# EAGLE design sensor (EAGLE 6.6.0)
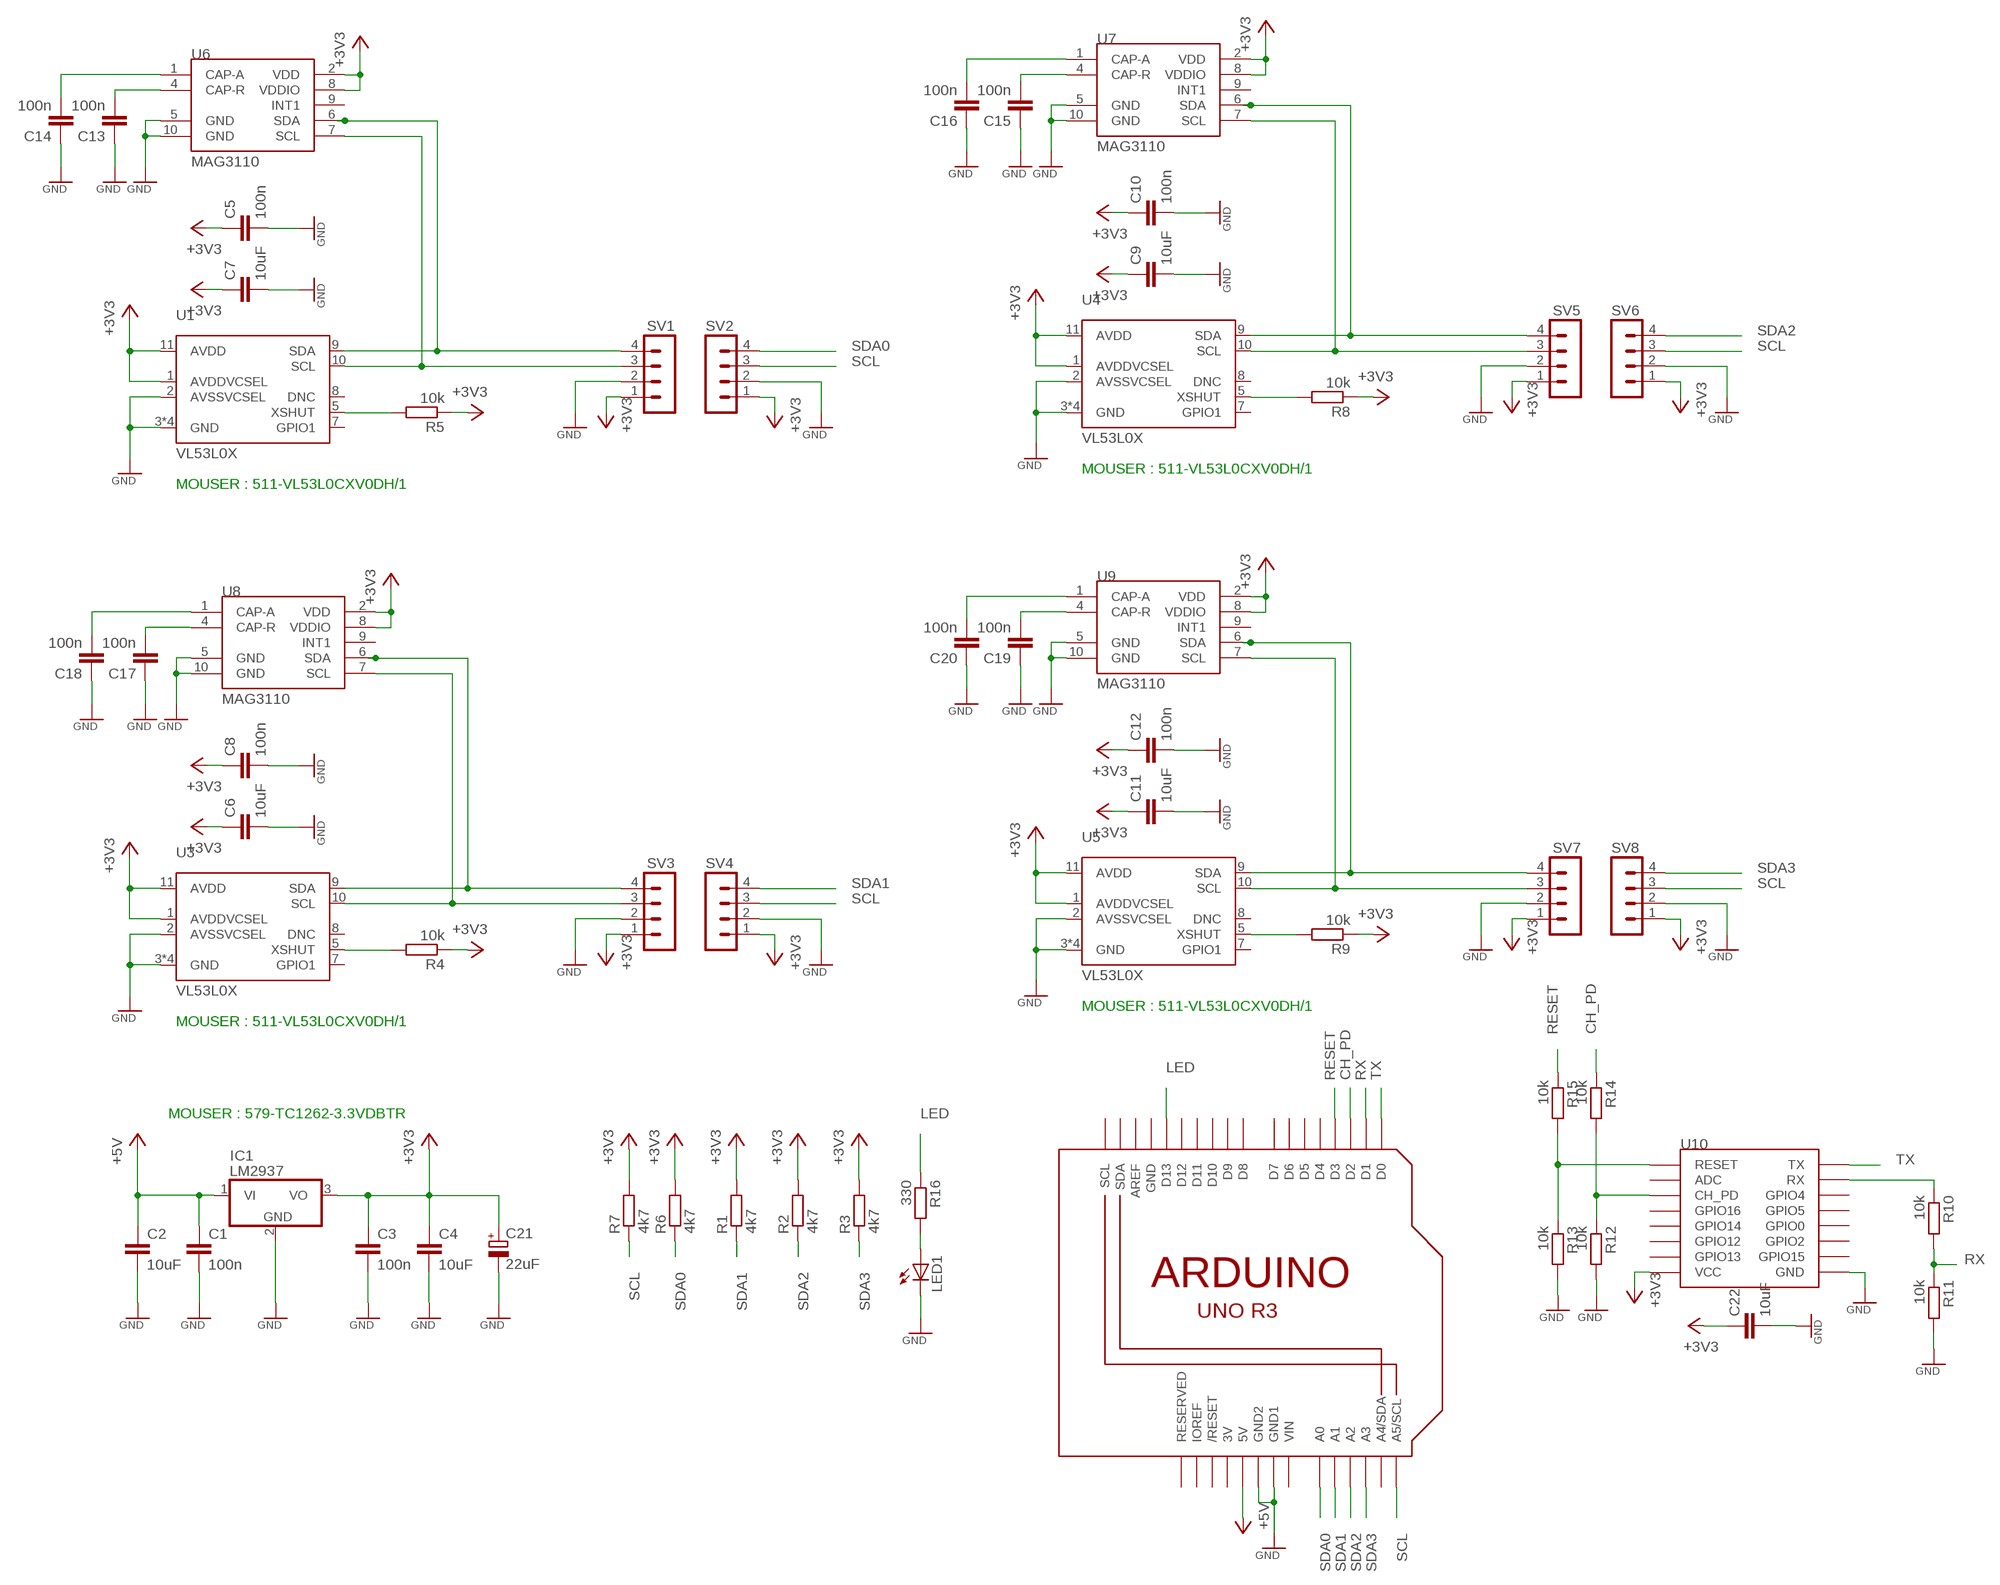
[diagram p0: schematic, sheet 1]

## Parts
C1  100n  C-EUC0805K  [C0805K]
C2  10uF  C-EUC0805K  [C0805K]
C3  100n  C-EUC0805K  [C0805K]
C4  10uF  C-EUC0805K  [C0805K]
C5  100n  C-EUC0805K  [C0805K]
C6  10uF  C-EUC0805K  [C0805K]
C7  10uF  C-EUC0805K  [C0805K]
C8  100n  C-EUC0805K  [C0805K]
C9  10uF  C-EUC0805K  [C0805K]
C10  100n  C-EUC0805K  [C0805K]
C11  10uF  C-EUC0805K  [C0805K]
C12  100n  C-EUC0805K  [C0805K]
C13  100n  C-EUC0805K  [C0805K]
C14  100n  C-EUC0805K  [C0805K]
C15  100n  C-EUC0805K  [C0805K]
C16  100n  C-EUC0805K  [C0805K]
C17  100n  C-EUC0805K  [C0805K]
C18  100n  C-EUC0805K  [C0805K]
C19  100n  C-EUC0805K  [C0805K]
C20  100n  C-EUC0805K  [C0805K]
C21  22uF  CPOL-EU153CLV-0405  [153CLV-0405]
C22  10uF  C-EUC0805K  [C0805K]
IC1  LM2937  [TO263-3]
LED1  LEDSML1206  [SML1206]
R1  4k7  R-EU_R0805  [R0805]
R2  4k7  R-EU_R0805  [R0805]
R3  4k7  R-EU_R0805  [R0805]
R4  10k  R-EU_R0805  [R0805]
R5  10k  R-EU_R0805  [R0805]
R6  4k7  R-EU_R0805  [R0805]
R7  4k7  R-EU_R0805  [R0805]
R8  10k  R-EU_R0805  [R0805]
R9  10k  R-EU_R0805  [R0805]
R10  10k  R-EU_R0805  [R0805]
R11  10k  R-EU_R0805  [R0805]
R12  10k  R-EU_R0805  [R0805]
R13  10k  R-EU_R0805  [R0805]
R14  10k  R-EU_R0805  [R0805]
R15  10k  R-EU_R0805  [R0805]
R16  330  R-EU_R0805  [R0805]
SV1  MA04-1  [MA04-1]
SV2  MA04-1  [MA04-1]
SV3  MA04-1  [MA04-1]
SV4  MA04-1  [MA04-1]
SV5  MA04-1  [MA04-1]
SV6  MA04-1  [MA04-1]
SV7  MA04-1  [MA04-1]
SV8  MA04-1  [MA04-1]
U1  VL53L0X  [VL53L0X]
U2  ARDUINOR3-BPLACE  [ARDUINOR3-BPLACE]
U3  VL53L0X  [VL53L0X]
U4  VL53L0X  [VL53L0X]
U5  VL53L0X  [VL53L0X]
U6  MAG3110  [DFN-10]
U7  MAG3110  [DFN-10]
U8  MAG3110  [DFN-10]
U9  MAG3110  [DFN-10]
U10  ESP12SMD  [ESP12-SMD]

## Nets
+3V3: C3.1 C4.1 C5.1 C6.1 C7.1 C8.1 C9.1 C10.1 C11.1 C12.1 C21.+ C22.1 IC1.3(VO) R1.2 R2.2 R3.2 R4.1 R5.1 R6.2 R7.2 R8.1 R9.1 SV1.1 SV2.1 SV3.1 SV4.1 SV5.1 SV6.1 SV7.1 SV8.1 U1.1(AVDDVCSEL) U1.11(AVDD) U3.1(AVDDVCSEL) U3.11(AVDD) U4.1(AVDDVCSEL) U4.11(AVDD) U5.1(AVDDVCSEL) U5.11(AVDD) U6.2(VDD) U6.8(VDDIO) U7.2(VDD) U7.8(VDDIO) U8.2(VDD) U8.8(VDDIO) U9.2(VDD) U9.8(VDDIO) U10.VCC
+5V: C1.1 C2.1 IC1.1(VI) U2.5V
CH_PD: R14.1 U2.D2
GND [napajanie]: C1.2 C2.2 C3.2 C4.2 C5.2 C6.2 C7.2 C8.2 C9.2 C10.2 C11.2 C12.2 C13.1 C14.1 C15.1 C16.1 C17.1 C18.1 C19.1 C20.1 C21.- C22.2 IC1.2(GND) LED1.C R11.2 R12.2 R13.2 SV1.2 SV2.2 SV3.2 SV4.2 SV5.2 SV6.2 SV7.2 SV8.2 U1.2(AVSSVCSEL) U1.3(GND) U1.4(GND) U1.6(GND) U1.12(GND) U2.GND1 U2.GND2 U3.2(AVSSVCSEL) U3.3(GND) U3.4(GND) U3.6(GND) U3.12(GND) U4.2(AVSSVCSEL) U4.3(GND) U4.4(GND) U4.6(GND) U4.12(GND) U5.2(AVSSVCSEL) U5.3(GND) U5.4(GND) U5.6(GND) U5.12(GND) U6.5(GND) U6.10(GND) U7.5(GND) U7.10(GND) U8.5(GND) U8.10(GND) U9.5(GND) U9.10(GND) U10.GND
LED: R16.1 U2.D13
N$1: SV1.3 U1.10(SCL) U6.7(SCL)
N$2: R5.2 U1.5(XSHUT)
N$3: SV1.4 U1.9(SDA) U6.6(SDA)
N$4: R4.2 U3.5(XSHUT)
N$5: R10.1 U10.RXD0(RX)
N$6: R12.1 R14.2 U10.CH_PD
N$7: R8.2 U4.5(XSHUT)
N$8: SV3.3 U3.10(SCL) U8.7(SCL)
N$9: SV3.4 U3.9(SDA) U8.6(SDA)
N$10: R9.2 U5.5(XSHUT)
N$11: LED1.A R16.2
N$13: C13.2 U6.4(CAP-R)
N$14: C14.2 U6.1(CAP-A)
N$15: SV5.3 U4.10(SCL) U7.7(SCL)
N$16: SV5.4 U4.9(SDA) U7.6(SDA)
N$17: C15.2 U7.4(CAP-R)
N$18: C16.2 U7.1(CAP-A)
N$19: C17.2 U8.4(CAP-R)
N$20: C18.2 U8.1(CAP-A)
N$21: SV7.3 U5.10(SCL) U9.7(SCL)
N$22: SV7.4 U5.9(SDA) U9.6(SDA)
N$23: C19.2 U9.4(CAP-R)
N$24: C20.2 U9.1(CAP-A)
N$25: R13.1 R15.2 U10.RESET
RESET: R15.1 U2.D3
RX: R10.2 R11.1 U2.D1
SCL: R7.1 SV2.3 SV4.3 SV6.3 SV8.3 U2.A5(A5/SCL)
SDA0: R6.1 SV2.4 U2.A0
SDA1: R1.1 SV4.4 U2.A1
SDA2: R2.1 SV6.4 U2.A2
SDA3: R3.1 SV8.4 U2.A3
TX: U2.D0 U10.TXD0(TX)
Unconnected: U1.7(GPIO1) U1.8(DNC) U2.A4(A4/SDA) U2.AREF U2.D4 U2.D5 U2.D6 U2.D7 U2.D8 U2.D9 U2.D10 U2.D11 U2.D12 U2.IOREF U2.RESERVED U2.RESET(/RESET) U2.SCL U2.SDA U3.7(GPIO1) U3.8(DNC) U4.7(GPIO1) U4.8(DNC) U5.7(GPIO1) U5.8(DNC) U6.9(INT1) U7.9(INT1) U8.9(INT1) U9.9(INT1) U10.ADC U10.GPIO0 U10.GPIO2 U10.GPIO4 U10.GPIO5 U10.GPIO12 U10.GPIO13 U10.GPIO14 U10.GPIO15 U10.GPIO16

## Notes on the sheet
- MOUSER : 511-VL53L0CXV0DH/1
- MOUSER : 511-VL53L0CXV0DH/1
- MOUSER : 511-VL53L0CXV0DH/1
- MOUSER : 511-VL53L0CXV0DH/1
- MOUSER : 579-TC1262-3.3VDBTR

## Power pins joined to a net without a drawn wire
3V: U2.3V
GND: U2.GND
VIN: U2.VIN

## Library data of the parts
C1-C20 C22 = resistor:C-EU: CAPACITOR, European symbol
C21 = resistor:CPOL-EU: POLARIZED CAPACITOR, European symbol
IC1 = linear:LM2937: LM2937-2.5, LM2937-3.3 400mA and 500mA Voltage Regulators Source: http://cache.national.com/ds/LM/LM2937-2.5.pdf
LED1 = led:LED: LED OSRAM: - CHIPLED LG R971, LG N971, LY N971, LG Q971, LY Q971, LO R971, LY R971 LH N974, LH R974 LS Q976, LO Q976, LY Q976 LO Q996 - Hyper CHIPLED LW Q18S LB Q993, LB Q99A, LB R99A - SideLED LS A670, LO A670, LY A670, LG A670, LP A670 LB A673, LV A673, LT A673, LW A673 LH A674 LY A675 LS A676, LA A676, LO A676, LY A676, LW A676 LS A679, LY A679, LG A679 - Hyper Micro SIDELED® LS Y876, LA Y876, LO Y876, LY Y876 LT Y87S - SmartLED LW L88C, LW L88S LB L89C, LB L89S, LG L890 LS L89K, LO L89K, LY L89K LS L896, LA L896, LO L896, LY L896 - TOPLED LS T670, LO T670, LY T670, LG T670, LP T670 LSG T670, LSP T670, LSY T670, LOP T670, LYG T670 LG T671, LOG T671, LSG T671 LB T673, LV T673, LT T673, LW T673 LH T674 LS T676, LA T676, LO T676, LY T676, LB T676, LH T676, LSB T676, LW T676 LB T67C, LV T67C, LT T67C, LS T67K, LO T67K, LY T67K, LW E67C LS E67B, LA E67B, LO E67B, LY E67B, LB E67C, LV E67C, LT E67C LW T67C LS T679, LY T679, LG T679 LS T770, LO T770, LY T770, LG T770, LP T770 LB T773, LV T773, LT T773, LW T773 LH T774 LS E675, LA E675, LY E675, LS T675 LS T776, LA T776, LO T776, LY T776, LB T776 LHGB T686 LT T68C, LB T68C - Hyper Mini TOPLED® LB M676 - Mini TOPLED Santana® LG M470 LS M47K, LO M47K, LY M47K Source: http://www.osram.convergy.de LUXEON: - LUMILED® LXK2-PW12-R00, LXK2-PW12-S00, LXK2-PW14-U00, LXK2-PW14-V00 LXK2-PM12-R00, LXK2-PM12-S00, LXK2-PM14-U00 LXK2-PE12-Q00, LXK2-PE12-R00, LXK2-PE12-S00, LXK2-PE14-T00, LXK2-PE14-U00 LXK2-PB12-K00, LXK2-PB12-L00, LXK2-PB12-M00, LXK2-PB14-N00, LXK2-PB14-P00, LXK2-PB14-Q00 LXK2-PR12-L00, LXK2-PR12-M00, LXK2-PR14-Q00, LXK2-PR14-R00 LXK2-PD12-Q00, LXK2-PD12-R00, LXK2-PD12-S00 LXK2-PH12-R00, LXK2-PH12-S00 LXK2-PL12-P00, LXK2-PL12-Q00, LXK2-PL12-R00 Source: www.luxeon.com KINGBRIGHT: KA-3528ASYC Source: www.kingbright.com
R1-R16 = resistor:R-EU_: RESISTOR, European symbol
SV1-SV8 = con-lstb:MA04-1: PIN HEADER; OC_FARNELL: unknown; OC_NEWARK: unknown
U1 U3-U5 = VL53L0X:VL53L0X: VL53L0X distance sensor
U2 = adafruit:ARDUINOR3: This is a new object for the new Arduino R3 - with extra pins that you may want to use (such as IOref, and duplicated A4/A5
U6-U9 = SparkFun-Sensors:MAG3110: 3-axis digital (I2C) magnetometer
U10 = esp8266modules:ESP12: ESP8266 Wifi module 12

## Net classes
0 default: width 0.305 mm, drill 1.092 mm, clearance 0.305 mm
1 napajanie: width 0.61 mm, drill 1.092 mm, clearance 0.305 mm to class 0, clearance 0.305 mm
2 mostik: width 0.203 mm, drill 0.584 mm, clearance 0.203 mm to class 0, clearance 0.203 mm to class 1, clearance 0.203 mm

## Board
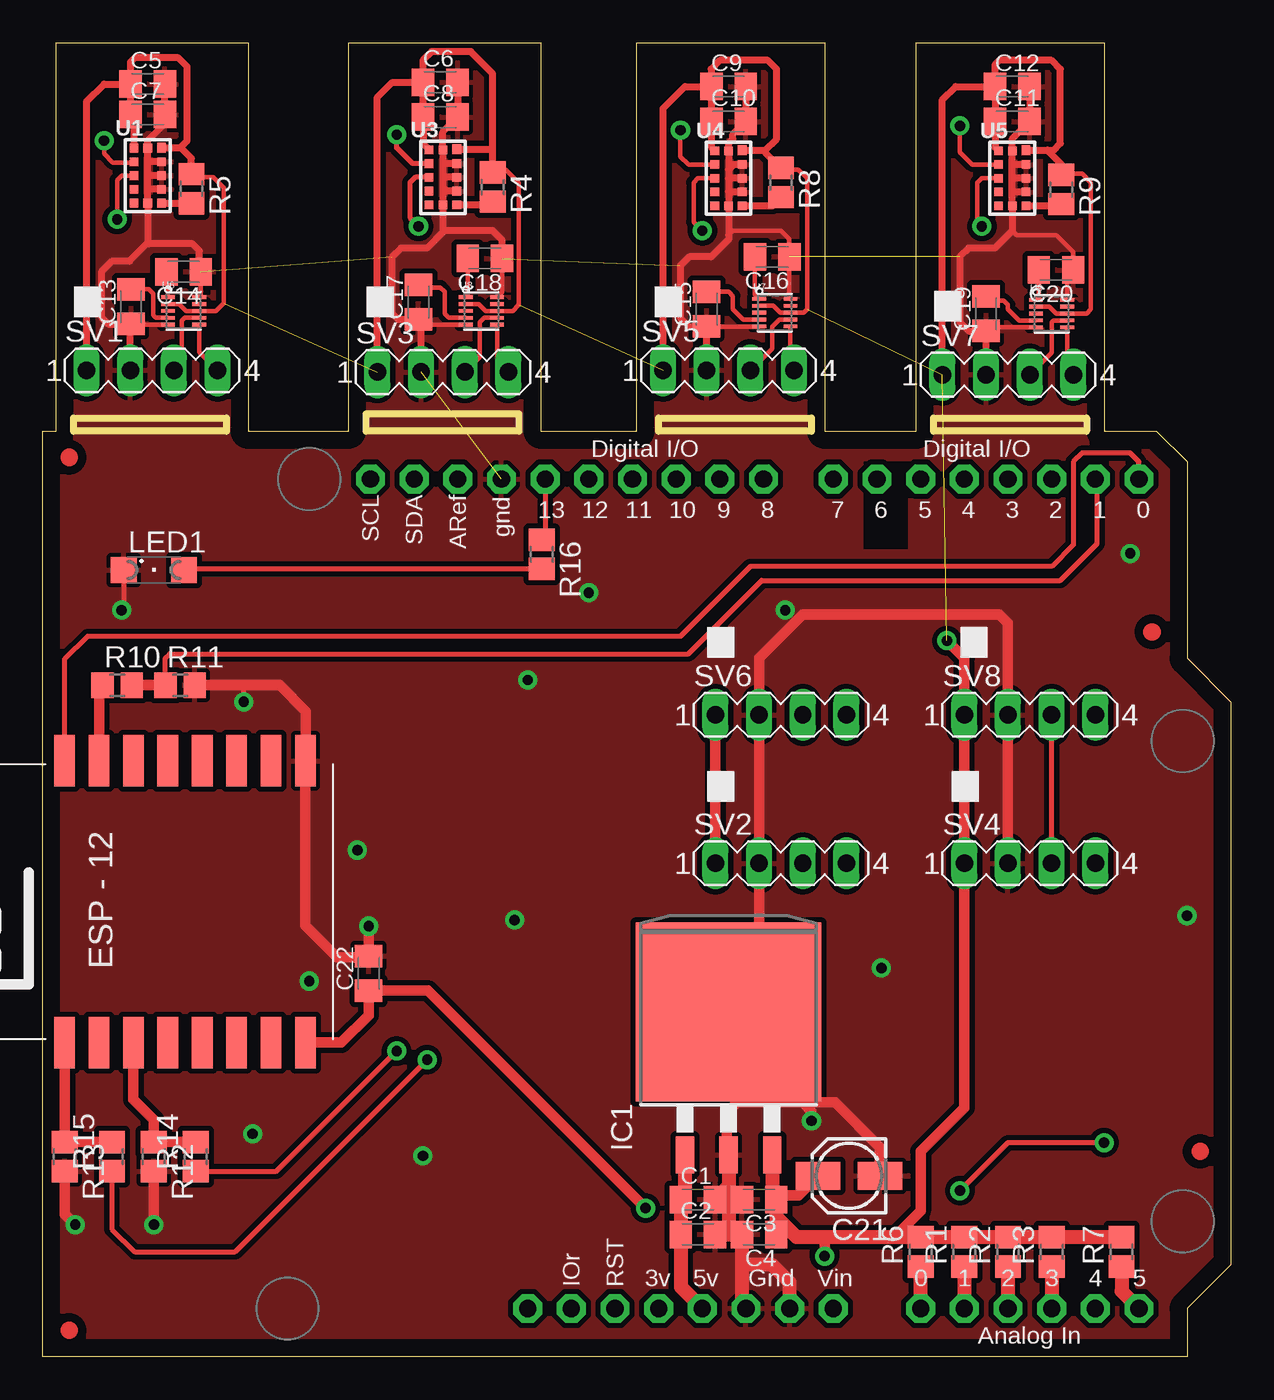
[diagram p1: board, top side]
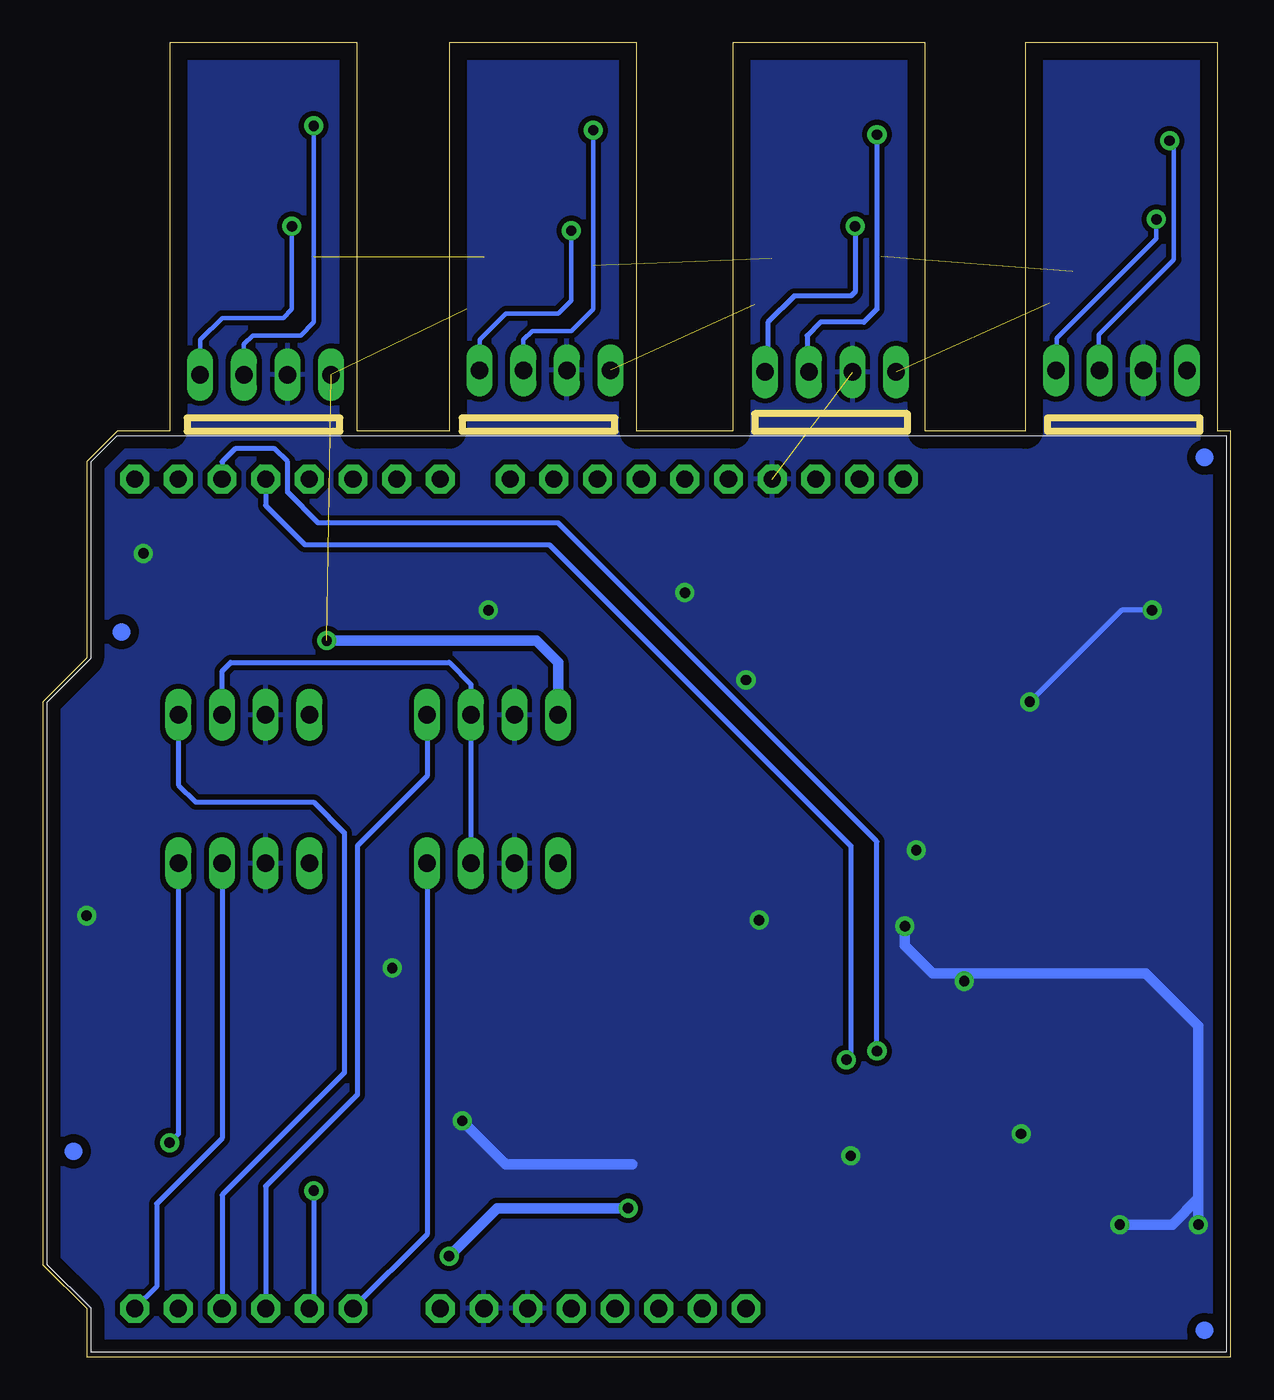
[diagram p2: board, bottom side, seen from below]

Size 69.09 x 76.44 mm. Coordinates in mm from the lower left corner, seen from the top.
Outline: 0.76,53.85 0.76,76.44 11.94,76.44 11.94,53.85 17.78,53.85 17.78,76.44 28.96,76.44 28.96,53.85 34.54,53.85 34.54,76.44 45.47,76.44 45.47,53.85 50.8,53.85 50.8,76.44 61.72,76.44 61.72,53.85 64.77,53.85 66.55,52.07 66.55,40.64 69.09,38.1 69.09,5.33 66.55,2.79 66.55,0 0,0 0,53.85 0.76,53.85
Copper layers (1*16): Top 0.035mm / dielectric 1.5mm / Bottom 0.035mm
Design rules "default *": minimum track width 12mil, minimum drill 5mil, track to track 10mil, track to pad 10mil, pad to pad 10mil, via to via 10mil, smd to smd 10mil, copper to edge 40mil, drill to drill 8mil, minimum pad ring 1mil, minimum via ring 10mil, stop-mask expansion 4mil, vias tented up to drill 0mil, thermal gap 10mil
tKeepout: area 47.8,47 to 50.3,52.1
tRestrict: area 47.8,47 to 50.3,52.1
Milling: area 1.8,53.8 to 10.7,54.6; area 18.8,53.8 to 27.7,54.9; area 35.8,53.8 to 44.7,54.6; area 51.8,53.8 to 60.7,54.6

### Footprints (pad centres in the part's own frame; a part is rotated, then mirrored left to right if it is on the bottom)
C0805K = smd 1.3 x 1.6: 1 -1,0; 2 1,0
153CLV-0405 = smd 2.6 x 1.6: + 1.8,0; - -1.8,0
TO263-3 = smd 1.067 x 2.159: 1 -2.54,-5.791; 2 0,-5.791; 3 2.54,-5.791 | smd 10.8 x 10.41: TAB 0,2.54
SML1206 = smd 1.5 x 1.5: A 1.75,0; C -1.75,0
R0805 = smd 1.3 x 1.5: 1 -0.85,0; 2 0.85,0
MA04-1 = drill 1.016 long: 1 -3.81,0; 2 -1.27,0; 3 1.27,0; 4 3.81,0
VL53L0X = smd 0.5 x 0.58: 1 0.8,1.64 | smd 0.5 x 0.5: 2 0.8,0.8; 3 0.8,0; 4 0.8,-0.8; 5 0.8,-1.6; 6 0,-1.6; 7 -0.8,-1.6; 8 -0.8,-0.8; 9 -0.8,0; 10 -0.8,0.8; 11 -0.8,1.6; 12 0,1.6
ARDUINOR3-BPLACE = drill 1 pad 1.676 octagon: 3V 35.56,2.54; 5V 38.1,2.54; A0 50.8,2.54; A1 53.34,2.54; A2 55.88,2.54; A3 58.42,2.54; A4 60.96,2.54; A5 63.5,2.54; AREF 23.876,50.8; D0 63.5,50.8; D1 60.96,50.8; D2 58.42,50.8; D3 55.88,50.8; D4 53.34,50.8; D5 50.8,50.8; D6 48.26,50.8; D7 45.72,50.8; D8 41.656,50.8; D9 39.116,50.8; D10 36.576,50.8; D11 34.036,50.8; D12 31.496,50.8; D13 28.956,50.8; GND 26.416,50.8; GND1 43.18,2.54; GND2 40.64,2.54; IOREF 30.48,2.54; RESERVED 27.94,2.54; RESET 33.02,2.54; SCL 18.796,50.8; SDA 21.336,50.8; VIN 45.72,2.54
DFN-10 = smd 0.8 x 0.22: 1 -0.91,0.8; 2 -0.91,0.4; 3 -0.91,0; 4 -0.91,-0.4; 5 -0.91,-0.8; 6 0.91,-0.8; 7 0.91,-0.4; 8 0.91,0; 9 0.91,0.4; 10 0.91,0.8
ESP12-SMD = smd 3 x 1.2: ADC -8.3,3.8; CH_PD -8.3,1.8; GND 8.1,-8.2; GPIO0 8.1,-2.2; GPIO2 8.1,-4.2; GPIO4 8.1,1.8; GPIO5 8.1,-0.2; GPIO12 -8.3,-4.2; GPIO13 -8.3,-6.2; GPIO14 -8.3,-2.2; GPIO15 8.1,-6.2; GPIO16 -8.3,-0.2; RESET -8.3,5.8; RXD0 8.1,3.8; TXD0 8.1,5.8; VCC -8.3,-8.2

### Placement (x,y rotation side)
C1  38.1,9.14 0 top
C2  38.1,7.11 0 top
C3  41.66,9.14 180 top
C4  41.66,7.11 180 top
C5  6.1,74.05 0 top
C6  23.11,74.15 0 top
C7  6.1,72.27 0 top
C8  23.11,72.12 0 top
C9  39.88,73.9 0 top
C10  39.88,71.87 0 top
C11  56.39,71.87 0 top
C12  56.39,73.9 0 top
C13  5.13,61.1 90 top
C14  8.18,63.13 180 top
C15  38.61,60.94 90 top
C16  42.42,63.99 180 top
C17  21.84,61.35 90 top
C18  25.7,63.89 180 top
C19  54.86,60.69 90 top
C20  58.93,63.23 180 top
C21  46.89,10.52 180 top
C22  18.95,22.3 90 top
IC1  39.88,17.53 0 top
LED1  6.45,45.77 0 top
R1  53.59,6.1 90 top
R2  56.13,6.1 90 top
R3  58.67,6.1 90 top
R4  26.16,68.06 270 top
R5  8.64,67.95 270 top
R6  51.05,6.1 90 top
R7  62.74,6.1 90 top
R8  42.93,68.31 270 top
R9  59.23,67.9 270 top
R10  4.32,39.07 0 top
R11  7.98,39.07 0 top
R12  6.45,11.63 270 top
R13  1.27,11.63 270 top
R14  8.89,11.63 90 top
R15  4.01,11.63 90 top
R16  29.01,46.69 270 top
SV1  6.35,57.39 0 top
SV2  42.93,28.7 0 top
SV3  23.27,57.29 0 top
SV4  57.4,28.7 0 top
SV5  39.88,57.39 0 top
SV6  42.93,37.34 0 top
SV7  56.13,57.13 0 top
SV8  57.4,37.34 0 top
U1  6.1,68.72 0 top
U2  0.25,0.25 0 top
U3  23.27,68.61 0 top
U4  39.88,68.56 0 top
U5  56.39,68.56 0 top
U6  8.18,60.84 0 top
U7  42.57,60.74 0 top
U8  25.5,60.84 0 top
U9  58.67,60.69 0 top
U10  7.06,26.57 90 top
U$1  [CIRCLE-1MM-2R]  64.52,42.16 0 top
U$2  [CIRCLE-1MM-2R]  1.52,52.32 0 top
U$3  [CIRCLE-1MM-2R]  1.52,1.52 0 top
U$4  [CIRCLE-1MM-2R]  67.31,11.94 0 top

### Tracks (layer width: path | path; a pad name or v marks a point on that pad's centre or on a via)
+3V3  (via drill 0.6)  (4 unrouted)
  Top 0.254: U6.2 7.93,61.24 8.33,60.84 U6.8 10.06,60.84 10.52,61.3 10.52,68 9.91,68.61 8.83,68.61 R5.1 | R4.1 26.33,69.07 26.92,69.07 27.69,68.31 27.69,61.2 27.33,60.84 U8.8 25.76,60.84 25.36,61.24 U8.2 | U7.2 42.48,61.14 42.88,60.74 U7.8 44.25,60.74 44.45,60.94 44.45,68.56 43.94,69.07 43.01,69.07 R8.1 | U9.2 58.53,61.09 58.93,60.69 U9.8 60.71,60.69 60.96,60.94 60.96,68.31 60.45,68.82 59.3,68.82 R9.1
  Top 0.406: SV1.1 2.54,73.03 3.56,74.05 C5.1 | C5.1 C7.1 5.3,72.07 U1.11 | R5.1 8.64,69.73 8.01,70.36 U1.1 7.99,70.36 8.38,70.75 8.38,75.07 7.87,75.57 5.33,75.57 5.08,75.32 5.08,74.07 C5.1 | SV3.1 19.46,73.29 20.32,74.15 C6.1 | U3.11 22.11,70.57 C8.1 C6.1 | R4.1 26.16,70.34 | 26.16,70.34 26.16,74.66 24.89,75.93 22.61,75.93 22.1,75.42 22.1,74.17 C6.1 | U3.1 26.07,70.25 26.16,70.34 | SV5.1 36.07,72.63 37.34,73.9 C9.1 | U4.11 38.88,70.36 C10.1 C9.1 | U4.1 42.03,70.2 | 42.03,70.2 42.67,70.85 42.67,74.91 42.16,75.42 39.37,75.42 38.86,74.91 38.86,73.91 C9.1 | 42.03,70.2 42.03,70.06 R8.1 | SV7.1 52.32,73.14 53.09,73.9 C12.1 | U5.11 55.39,70.36 C11.1 C12.1 | U5.1 58.42,70.2 | 58.42,70.2 58.79,70.2 59.18,70.6 59.18,74.91 58.67,75.42 55.63,75.42 55.37,75.17 55.37,73.91 C12.1 | R9.1 59.23,69.39 58.42,70.2
  Top 0.61: 42.42,9.38 43.96,9.38 C21.+ | SV6.1 SV2.1 | v52.58,41.66 53.59,40.64 SV8.1 SV4.1 53.59,14.48 51.05,11.94 51.05,8.47 49.53,6.95 | U10.VCC 17.35,18.27 18.95,19.86 C22.1 22.39,21.3 v35.05,8.64 | v45.47,5.84 45.47,6.69 45.72,6.95
  Top 0.813: IC1.3 42.42,9.38 C3.1 42.66,8.13 | 42.66,8.13 42.66,7.64 42.67,7.62 42.67,7.13 C4.1 | R7.2 R3.2 R2.2 R1.2 R6.2 49.53,6.95 45.72,6.95 43.84,6.95 42.66,8.13
  Bottom 0.61: v52.58,41.66 40.39,41.66 39.12,40.39 SV6.1 | v35.05,8.64 42.67,8.64 v45.47,5.84
+5V
  Top 0.813: IC1.1 37.34,9.38 C1.1 C2.1 37.1,4.05 U2.5V
CH_PD  (via drill 0.6)
  Top 0.305: R14.1 13.58,10.78 v20.57,17.78
  Bottom 0.305: v20.57,17.78 20.57,29.97 39.12,48.51 53.09,48.51 54.86,50.29 54.86,52.07 55.63,52.83 57.91,52.83 58.67,52.07 U2.D2
GND  (via drill 0.6)  (4 unrouted)
  Top 0.254: U6.5 5.13,60.04 C13.1 | U6.10 9.18,61.73 C14.1 9.09,63.21 | U8.5 22.15,60.04 C17.1 | C18.1 26.7,61.94 U8.10 | U7.5 C15.1 | U7.10 43.42,61.6 C16.1 43.42,65.02 42.93,65.52 40.13,65.52 39.88,65.26 | 56.39,65.52 56.64,65.26 58.93,65.26 59.93,64.26 C20.1 59.58,62.89 U9.10 | U9.5 55.06,59.89 C19.1
  Top 0.305: LED1.C 4.7,43.56 v4.57,43.43 | v11.68,38.1 11.68,39.07
  Top 0.406: 6.1,67.95 U1.6 6.1,64.8 | 6.1,67.95 6.1,68.72 | 6.1,68.72 6.1,69.48 | 6.1,69.48 U1.12 6.1,70.75 6.86,71.51 6.86,72.03 C7.2 C5.2 | U1.2 6.13,69.52 6.1,69.48 | U1.3 6.1,68.72 | U1.4 6.13,67.92 6.1,67.95 | SV1.2 5.08,60.05 C13.1 5.12,60.08 3.81,60.08 3.4,60.49 3.4,63.13 4.01,63.74 5.03,63.74 6.1,64.8 | 9.09,63.21 9.09,64.35 8.69,64.75 6.15,64.75 6.1,64.8 | C6.2 C8.2 23.27,71.27 U3.12 23.27,69.33 | 23.27,69.33 23.27,68.56 | 23.27,68.56 23.27,68.06 | 23.27,68.06 U3.6 23.27,65.41 | U3.2 23.36,69.41 23.27,69.33 | U3.3 23.32,68.61 23.27,68.56 | U3.4 23.51,67.81 23.27,68.06 | SV3.2 22,60.2 C17.1 20.66,60.35 20.32,60.69 20.32,63.99 20.83,64.5 22.35,64.5 23.27,65.41 | C9.2 C10.2 40.13,71.12 40.13,70.85 39.88,70.6 U4.12 39.88,69.07 | 39.88,69.07 39.88,68.56 | 39.88,68.56 39.88,67.8 | 39.88,67.8 U4.6 39.88,65.26 39.88,65.01 38.86,63.99 37.59,63.99 37.08,63.48 37.08,60.44 37.59,59.93 38.59,59.93 C15.1 SV5.2 | U4.2 40.17,69.36 39.88,69.07 | U4.3 39.88,68.56 | U4.4 39.92,67.76 39.88,67.8 | C12.2 C11.2 56.39,70.87 U5.12 56.39,69.33 | 56.39,67.8 U5.6 56.39,65.52 55.37,64.5 53.85,64.5 53.34,63.99 53.34,60.18 53.85,59.67 54.85,59.67 C19.1 SV7.2 | 56.39,67.8 56.39,68.56 | 56.39,68.56 56.39,69.33 | U5.2 56.43,69.36 56.39,69.33 | U5.3 56.39,68.56 | U5.4 56.43,67.76 56.39,67.8 | C18.1 26.7,64.97 26.16,65.52 23.37,65.52 23.27,65.41
  Top 0.61: C21.- 48.69,12.17 46.08,14.78 44.2,14.78 | 44.2,14.78 40.39,14.78 | 40.39,14.78 39.78,14.17 39.78,11.84 IC1.2 | SV4.2 SV8.2 56.13,42.67 55.63,43.18 44.2,43.18 41.66,40.64 SV6.2 SV2.2 41.66,16.05 40.39,14.78 | R13.2 1.27,8.28 v1.88,7.67 | v18.95,25.04 C22.2 18.86,23.22 17.12,23.22 15.26,25.07 U10.GND 15.29,34.7 15.29,37.54 13.77,39.07 11.68,39.07 R11.2 | R12.2 v6.45,7.67 | v44.7,13.72 44.7,14.28 44.2,14.78
  Top 0.813: C3.2 C1.2 39.88,9.92 IC1.2 39.88,7.11 | 39.88,7.11 C4.2 40.66,5.33 | 39.88,7.11 C2.2 | 40.66,5.33 40.66,3.03 U2.GND2 | U2.GND1 43.43,4.32 42.42,5.33 40.66,5.33
  Bottom 0.305: v4.57,43.43 6.35,43.43 v11.68,38.1
  Bottom 0.61: v1.88,7.67 1.88,9.2 | 1.88,9.2 1.88,19.25 4.93,22.3 17.32,22.3 18.95,23.93 v18.95,25.04 | v6.45,7.67 3.4,7.67 1.88,9.2 | 34.8,11.18 42.16,11.18 v44.7,13.72
  other vias: 27.43,25.4 18.29,29.46 12.19,12.95 15.49,21.84 22.1,11.68 66.55,25.65 48.77,22.61 43.18,43.43 28.19,39.37 31.75,44.45 63.25,46.74
  pour Top: -18.54,84.07 -18.54,-6.35 88.65,-6.35 88.65,84.07
  pour Bottom: -29.21,86.36 -29.21,-6.1 122.68,-6.1 122.68,86.36
LED
  Top 0.305: U2.D13 29.21,47.74 R16.1
N$1  (via drill 0.6)
  Top 0.254: v3.56,70.75 3.56,69.99 4.06,69.48 5.26,69.48 U1.10 | U6.7 8.24,60.44 8.08,60.28 8.08,57.84 SV1.3
  Bottom 0.254: v3.56,70.75 3.3,70.49 3.3,63.84 7.67,59.47 7.67,57.44 SV1.3
N$2
  Top 0.406: U1.5 8.62,67.12 R5.2
N$3  (via drill 0.6)
  Top 0.254: v4.32,66.18 4.32,68.46 4.57,68.72 U1.9 | U6.6 9.09,58.46 SV1.4
  Bottom 0.254: v4.32,66.18 4.32,65.06 10.11,59.27 10.11,58.05 9.8,57.74 SV1.4
N$4
  Top 0.406: U3.5 25.97,67.02 R4.2
N$5
  Top 0.61: U10.RXD0 3.26,38.86 R10.1
N$6
  Top 0.61: U10.CH_PD 5.26,14.96 6.45,13.77 R12.1 R14.2
N$7
  Top 0.406: U4.5 42.43,66.96 R8.2
N$8  (via drill 0.6)
  Top 0.254: U8.7 25.66,60.44 25.4,60.18 25.4,58.15 SV3.3
  Top 0.305: U3.10 21.5,69.41 20.57,70.34 v20.57,71.1
  Bottom 0.305: v20.57,71.1 20.57,60.94 21.34,60.18 23.88,60.18 24.64,59.42 24.64,57.39 SV3.3
N$9  (via drill 0.6)
  Top 0.254: U8.6 26.41,57.95 SV3.4
  Top 0.305: U3.9 21.64,68.61 21.34,68.31 21.34,66.28 v21.84,65.77
  Bottom 0.305: v21.84,65.77 21.84,61.96 22.1,61.71 25.4,61.71 26.92,60.18 26.92,57.44 SV3.4
N$10
  Top 0.406: U5.5 59.14,66.96 R9.2
N$11
  Top 0.305: R16.2 8.78,45.84 8.64,45.97 8.41,45.97 LED1.A
N$13
  Top 0.254: U6.4 6.55,60.44 6.4,60.59 6.4,61.86 6.15,62.11 5.15,62.11 C13.2
N$14
  Top 0.254: U6.1 7.27,63.04 C14.2
N$15  (via drill 0.6)
  Top 0.254: U4.10 37.55,69.36 37.08,69.83 v37.08,71.36 | U7.7 42.83,60.34 42.42,59.93 42.42,58.66 SV5.3
  Bottom 0.254: v37.08,71.36 37.08,60.94 38.35,59.67 40.64,59.67 41.15,59.17 SV5.3
N$16  (via drill 0.6)
  Top 0.254: U4.9 38.1,68.56 37.85,68.31 37.85,66.02 v38.35,65.52 | U7.6 43.48,57.6 SV5.4
  Bottom 0.254: v38.35,65.52 38.35,61.45 39.12,60.69 42.16,60.69 43.69,59.17 SV5.4
N$17
  Top 0.254: U7.4 40.73,60.34 40.13,60.94 40.13,61.71 39.88,61.96 38.62,61.96 C15.2
N$18
  Top 0.254: C16.2 41.42,61.78 U7.1
N$19
  Top 0.254: U8.4 23.62,60.44 23.37,60.69 23.37,61.96 23.11,62.21 21.98,62.21 C17.2
N$20
  Top 0.254: C18.2 24.7,61.76 U8.1
N$21  (via drill 0.6)
  Top 0.254: U5.10 54.06,69.36 53.34,70.09 v53.34,71.61 | U9.7 58.78,60.29 58.67,60.18 58.67,58.4 SV7.3
  Bottom 0.254: v53.34,71.61 53.34,60.18 54.1,59.42 56.9,59.42 57.4,58.91 SV7.3
N$22  (via drill 0.6)
  Top 0.254: U5.9 54.61,68.56 54.36,68.31 54.36,66.02 v54.61,65.77 | U9.6 59.58,57.49 SV7.4
  Bottom 0.254: v54.61,65.77 54.61,60.94 55.12,60.44 58.67,60.44 59.94,59.17 SV7.4
N$23
  Top 0.254: U9.4 56.79,60.29 56.13,60.94 56.13,61.2 55.88,61.45 55.1,61.45 C19.2
N$24
  Top 0.254: C20.2 57.93,61.65 U9.1
N$25
  Top 0.61: U10.RESET R13.1 R15.2
RESET  (via drill 0.6)
  Top 0.305: R15.1 4.01,7.42 5.33,6.1 11.18,6.1 v22.35,17.27
  Bottom 0.305: U2.D3 56.13,49.53 53.85,47.24 39.62,47.24 22.1,29.72 22.1,17.53 v22.35,17.27
RX
  Top 0.305: R11.1 7.13,40.65 7.37,40.89 37.54,40.89 41.81,45.16 59.18,45.16 61.32,47.3 61.32,50.95 U2.D1
  Top 0.61: R10.2 R11.1
SCL
  Top 0.305: SV4.3 SV8.3
  Top 0.813: R7.1 62.74,3.81 U2.A5
  Bottom 0.305: SV4.3 58.67,12.7 62.48,8.89 62.48,4.06 U2.A5 | SV8.3 58.67,39.88 58.17,40.39 45.47,40.39 44.2,39.12 SV6.3 SV2.3
SDA0
  Top 0.813: U2.A0 R6.1
  Bottom 0.305: SV2.4 46.74,7.11 U2.A0
SDA1  (via drill 0.6)
  Top 0.305: v61.72,12.45 56.13,12.45 v53.34,9.65
  Top 0.813: R1.1 U2.A1
  Bottom 0.305: SV4.4 61.21,12.95 v61.72,12.45 | v53.34,9.65 53.34,3.05 U2.A1
SDA2
  Top 0.813: R2.1 U2.A2
  Bottom 0.305: SV6.4 46.74,33.78 50.8,29.72 50.8,15.24 56.13,9.91 U2.A2
SDA3
  Top 0.813: R3.1 U2.A3
  Bottom 0.305: SV8.4 61.21,33.27 60.2,32.26 53.34,32.26 51.56,30.48 51.56,16.51 58.67,9.4 U2.A3
TX
  Top 0.305: U10.TXD0 1.26,40.58 2.59,41.91 37.08,41.91 41.15,45.97 58.67,45.97 59.94,47.24 59.94,52.07 60.45,52.58 63.25,52.58 63.75,52.07 U2.D0

### Text on the board
tPlace: . | . | . | . | . | . | . | .